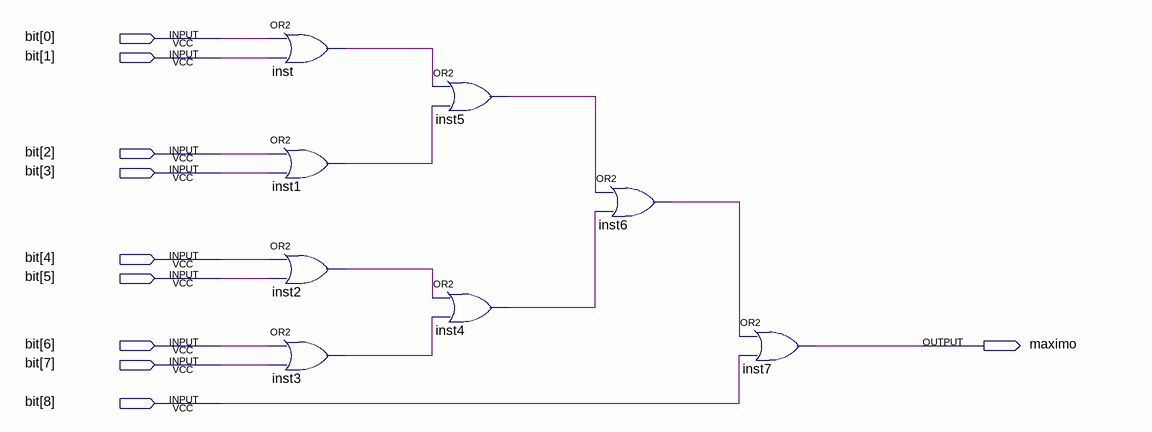
[diagram p0: schematic sheet]
// Quartus schematic maximo.bdf as structural Verilog: 8 symbols, 10 pins
module maximo (
  input  [8:0] \bit ,
  output maximo
);

  wire inst1_out, inst2_out, inst3_out, inst4_out, inst5_out, inst6_out, inst_out;

  or inst (inst_out, \bit [0], \bit [1]);
  or inst1 (inst1_out, \bit [2], \bit [3]);
  or inst2 (inst2_out, \bit [4], \bit [5]);
  or inst3 (inst3_out, \bit [6], \bit [7]);
  or inst5 (inst5_out, inst_out, inst1_out);
  or inst4 (inst4_out, inst2_out, inst3_out);
  or inst6 (inst6_out, inst5_out, inst4_out);
  or inst7 (maximo, inst6_out, \bit [8]);
endmodule
